# Altium schematic sheet h桥.SchDoc
size A4
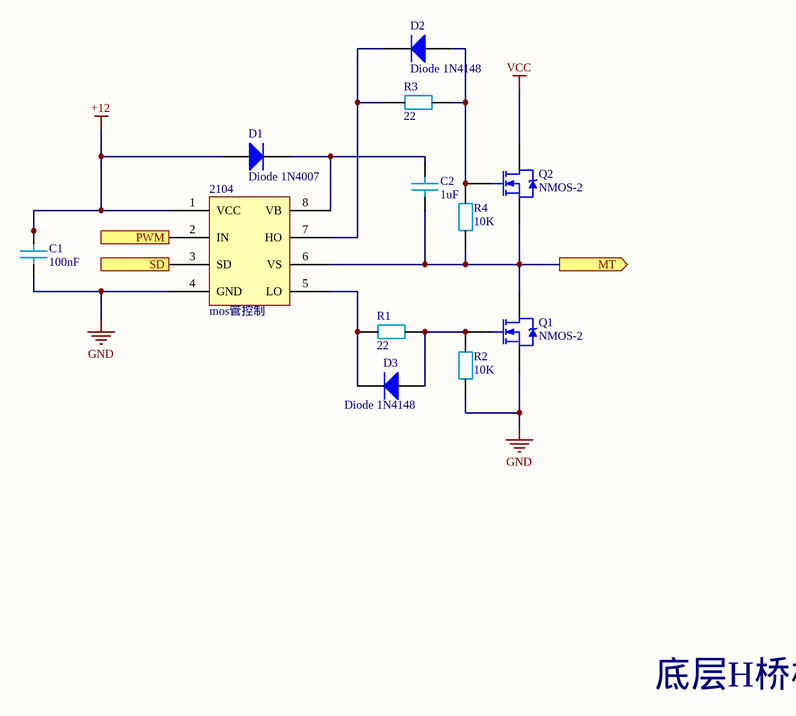
[diagram p0: h桥.SchDoc]

## Parts
2104  mos管控制  [SOP8]
C1  100nF  [0805_C]
C2  1uF  [0805_C]
D1  Diode 1N4007  [DO-41]
D2  Diode 1N4148  [DO-35]
D3  Diode 1N4148  [DO-35]
Q1  NMOS-2  [LC-TO-252-2]
Q2  NMOS-2  [LC-TO-252-2-180]
R1  22  [0805_R]
R2  10K  [0805_R]
R3  22  [0805_R]
R4  10K  [0805_R]

## Ports
MT (out), PWM (in), SD (in)

## Nets
+12: 2104.1(VCC) C1.2 D1.1(A)
GND: 2104.4(GND) C1.1 Q1.3(S) R2.2
VCC: Q2.2(D)
MT: 2104.6(VS) C2.1 Q1.2(D) Q2.3(S) R4.1 ; port MT
PWM: 2104.2(IN) ; port PWM
SD: 2104.3(SD) ; port SD
Net2104_5: 2104.5(LO) D3.2(K) R1.1
Net2104_7: 2104.7(HO) D2.2(K) R3.1
Net2104_8: 2104.8(VB) C2.2 D1.2(K)
NetD2_1: D2.1(A) Q2.1(G) R3.2 R4.2
NetD3_1: D3.1(A) Q1.1(G) R1.2 R2.1

## Notes on the sheet
- 底层H桥模块

## Library data of the parts
2104 = eg2104
C1 C2 = C
D1 = Diode 1N4007: 1 Amp General Purpose Rectifier; Published: 8-Jun-2000; LatestRevisionDate: 17-Jul-2002; LatestRevisionNote: Re-released for DXP Platform.; DatasheetVersion: 1998; PackageVersion: Aug-1999; PackageReference: DO-41; Publisher: Altium Limited; PackageDescription: Diode, Axial; Body 5.2 x 2.7 mm (LxDia. max), Lead Dia. 0.86 mm (max); Code_JEDEC: DO-204-AL; ComponentLink1Description: Manufacturer Link; ComponentLink1URL: http://www.fairchildsemi.com/; ComponentLink2Description: Datasheet; ComponentLink2URL: http://www.fairchildsemi.com/ds/1N%2F1N4001.pdf
D2 D3 = Diode 1N4148: High Conductance Fast Diode; Published: 8-Jun-2000; LatestRevisionDate: 17-Jul-2002; LatestRevisionNote: Re-released for DXP Platform.; DatasheetVersion: 1997; PackageReference: DO-35; Publisher: Altium Limited; PackageDescription: Diode, Axial; Body 3.8 x 1.9 mm (LxDia. max), Lead Dia. 0.53 mm (max); Code_JEDEC: DO-204-AH; ComponentLink1Description: Manufacturer Link; ComponentLink1URL: http://www.fairchildsemi.com/; ComponentLink2Description: Datasheet; ComponentLink2URL: http://www.fairchildsemi.com/ds/1N%2F1N4148.pdf
Q1 Q2 = NMOS-2: N-Channel Power MOSFET; Note: Pin 2 is electrically connected to pin 4.; Published: 8-Jun-2000; LatestRevisionDate: 17-Jul-2002; LatestRevisionNote: Re-released for DXP Platform.; DatasheetVersion: PD-9.814; PackageVersion: Feb-1997; PackageReference: TO-220AB; Publisher: Altium Limited; PackageDescription: TO, Thru-Hole, Vertical, Heatsink Mounted; 3 In-Line Leads; Pitch 2.54 mm; ComponentLink1Description: Manufacturer Link; ComponentLink1URL: http://www.irf.com/
R1-R4 = R